# Altium schematic sheet Sensors.SchDoc
size A4; SheetNumber: 3; SheetTotal: 4
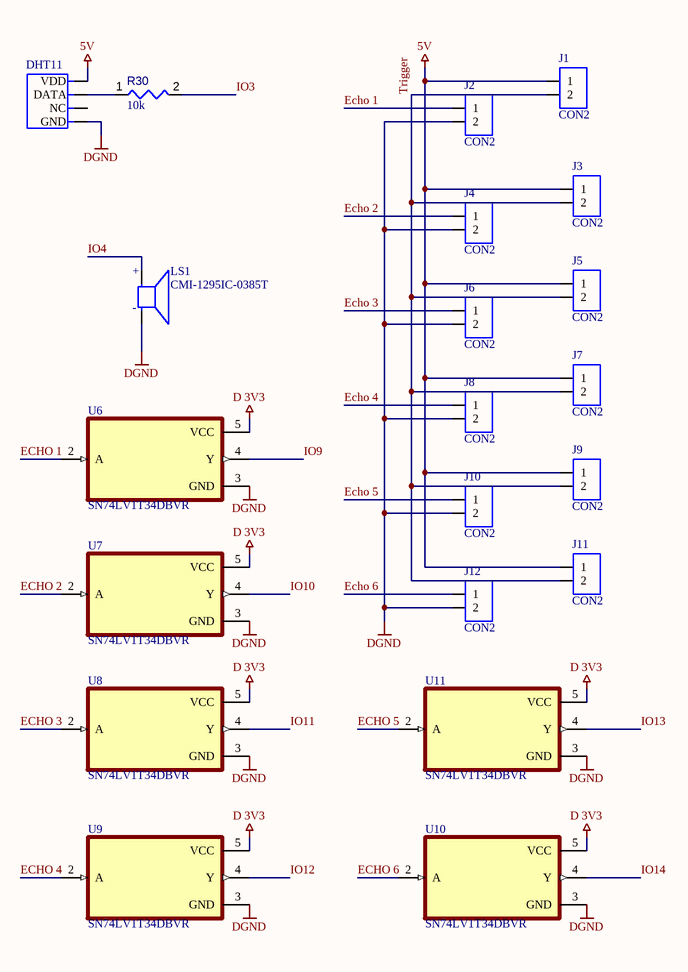
[diagram p0: Sensors.SchDoc]

## Parts
DHT11  TEM-HUM-DHT11(4P-15.5X12.0MM)  [SNR4-2.54-15.5X12.0X5.5MM]  (value not drawn)
J1  CON2  [SIP-2]
J2  CON2  [SIP-2]
J3  CON2  [SIP-2]
J4  CON2  [SIP-2]
J5  CON2  [SIP-2]
J6  CON2  [SIP-2]
J7  CON2  [SIP-2]
J8  CON2  [SIP-2]
J9  CON2  [SIP-2]
J10  CON2  [SIP-2]
J11  CON2  [SIP-2]
J12  CON2  [SIP-2]
LS1  CMI-1295IC-0385T  [CUI_CMI-1295IC-0385T]
R30  value 10k  [RESC1608X55X25ML10T15]  (hidden comment: Resistor 10k +/-1% 0603 100 mW)
U6  SN74LV1T34DBVR  [SOT95P280X145-5N]
U7  SN74LV1T34DBVR  [SOT95P280X145-5N]
U8  SN74LV1T34DBVR  [SOT95P280X145-5N]
U9  SN74LV1T34DBVR  [SOT95P280X145-5N]
U10  SN74LV1T34DBVR  [SOT95P280X145-5N]
U11  SN74LV1T34DBVR  [SOT95P280X145-5N]

## Nets
5V: DHT11.1(VDD) J1.1 J3.1 J5.1 J7.1 J9.1 J11.1
D 3V3: U6.5(VCC) U7.5(VCC) U8.5(VCC) U9.5(VCC) U10.5(VCC) U11.5(VCC)
DGND: DHT11.4(GND) J2.2 J4.2 J6.2 J8.2 J10.2 J12.2 LS1.N U6.3(GND) U7.3(GND) U8.3(GND) U9.3(GND) U10.3(GND) U11.3(GND)
Echo 1: J2.1 U6.2(A)
Echo 2: J4.1 U7.2(A)
Echo 3: J6.1 U8.2(A)
Echo 4: J8.1 U9.2(A)
Echo 5: J10.1 U11.2(A)
Echo 6: J12.1 U10.2(A)
IO3: R30.2
IO4: LS1.P
IO9: U6.4(Y)
IO10: U7.4(Y)
IO11: U8.4(Y)
IO12: U9.4(Y)
IO13: U11.4(Y)
IO14: U10.4(Y)
Trigger: J1.2 J3.2 J5.2 J7.2 J9.2 J11.2
NetDHT11_2: DHT11.2(DATA) R30.1

Not connected (* = marked no-connect by the designer): DHT11 3(NC)

## Notes on the sheet
- (in symbol CMI-1295IC-0385T) +; -

## Library data of the parts
DHT11 = TEM-HUM-DHT11(4P-15.5X12.0MM): Äá»™ áº©m, nhiá»‡t Ä‘á»™ Ká»¹ thuáº­t sá»‘ Â±5% RH qua lá»—; MF: UNIVERSAL-SOLDER Electronics Ltd; MP: DHT11; SnapEDA_Link: https://www.snapeda.com/parts/DHT11/UNIVERSAL-SOLDER+Electronics+Ltd/view-part/?ref=snap; Package: None; Value: *; Check_prices: https://www.snapeda.com/parts/DHT11/UNIVERSAL-SOLDER+Electronics+Ltd/view-part/?ref=eda
J1-J12 = CON2: Stecker
LS1 = CMI-1295IC-0385T: 12 mm, 3 Vdc, 85 dB, Through Hole, Driving Circuit, Magnetic Audio Indicator Buzzer; MF: Same Sky; SnapEDA_Link: https://www.snapeda.com/parts/CMI-1295IC-0385T/Same+Sky/view-part/?ref=snap; Package: Package; Value: *; MP: CMI-1295IC-0385T; Check_prices: https://www.snapeda.com/parts/CMI-1295IC-0385T/Same+Sky/view-part/?ref=eda
R30 = CMP-009-00017-5: Chip Resistor, 10 KOhm, +/- 1%, 01 W, -55 to 155 degC, 0603 (1608 Metric); Voltage Rating: 50V; Power: 100mW; RoHS Compliant: True; Min Operating Temperature: -55°C; Pins: 2; Case/Package: 0603; Mounting Technology: SM; Max Operating Temperature: 155°C; Tolerance: 1%
U6-U11 = SN74LV1T34DBVR: Single Power Supply BUFFER Logic Level Shifter (no enable); MF: Texas Instruments; SnapEDA_Link: https://www.snapeda.com/parts/SN74LV1T34DBVR/Texas+Instruments/view-part/?ref=snap; Package: SOT-23-5 Texas Instruments; Value: *; MP: SN74LV1T34DBVR; Check_prices: https://www.snapeda.com/parts/SN74LV1T34DBVR/Texas+Instruments/view-part/?ref=eda